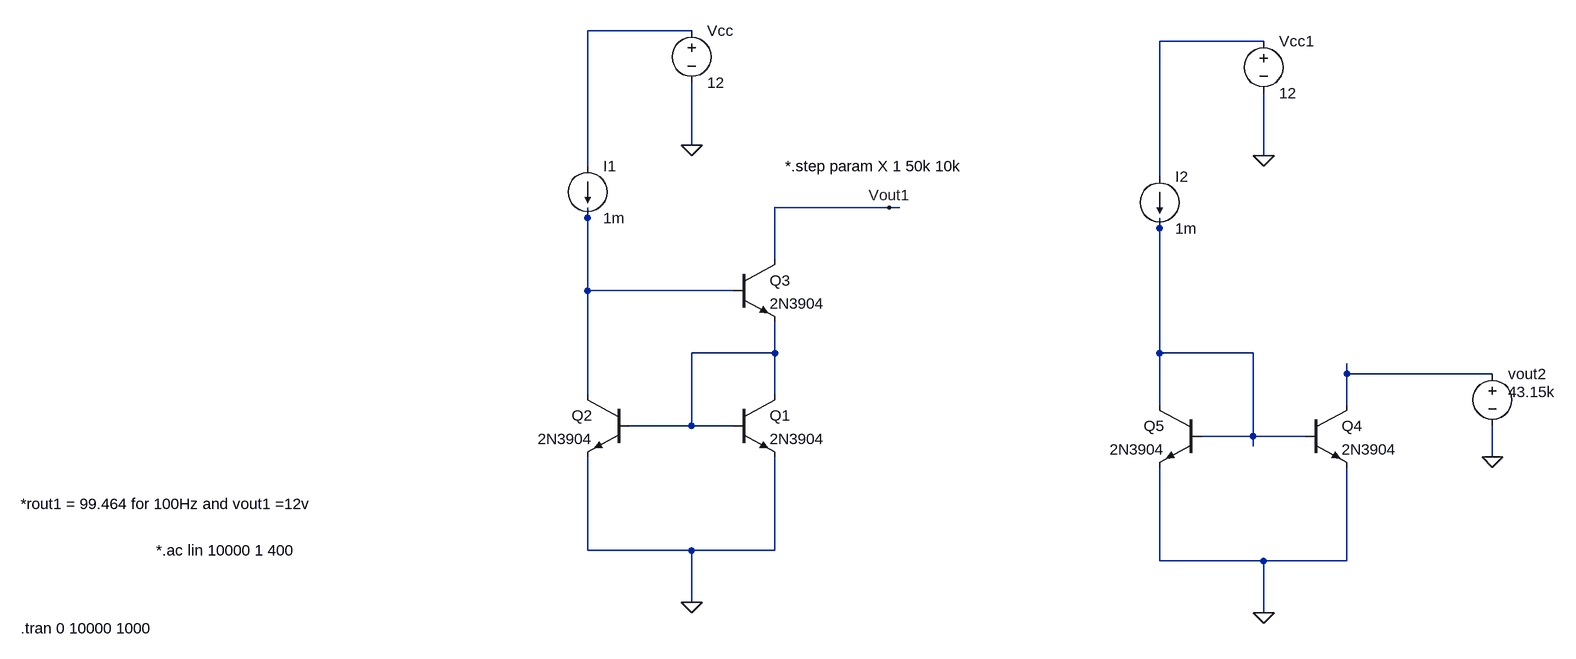
[diagram p0: schematic ask3.asc]
ask3.asc, the LTspice schematic file:
Version 4
SHEET 1 1724 680
WIRE 112 -640 -48 -640
WIRE 992 -624 832 -624
WIRE 112 -464 112 -560
WIRE 992 -448 992 -544
WIRE -48 -432 -48 -640
WIRE 832 -416 832 -624
WIRE 416 -368 240 -368
WIRE 432 -368 416 -368
WIRE -48 -352 -48 -368
WIRE 832 -336 832 -352
WIRE 240 -288 240 -368
WIRE -48 -240 -48 -352
WIRE 176 -240 -48 -240
WIRE 240 -144 240 -192
WIRE 240 -144 112 -144
WIRE 832 -144 832 -336
WIRE 976 -144 832 -144
WIRE 1120 -112 1120 -128
WIRE 1344 -112 1120 -112
WIRE -48 -80 -48 -240
WIRE 240 -80 240 -144
WIRE 832 -64 832 -144
WIRE 1120 -64 1120 -112
WIRE 112 -32 112 -144
WIRE 112 -32 16 -32
WIRE 176 -32 112 -32
WIRE 976 -16 976 -144
WIRE 976 -16 896 -16
WIRE 1056 -16 976 -16
WIRE 976 0 976 -16
WIRE 1344 16 1344 -32
WIRE -48 160 -48 16
WIRE 112 160 -48 160
WIRE 240 160 240 16
WIRE 240 160 112 160
WIRE 832 176 832 32
WIRE 992 176 832 176
WIRE 1120 176 1120 32
WIRE 1120 176 992 176
WIRE 112 240 112 160
WIRE 992 256 992 176
FLAG 112 240 0
FLAG 112 -464 0
FLAG 992 256 0
FLAG 992 -448 0
FLAG 1344 16 0
FLAG 416 -368 Vout1
SYMBOL npn 176 -80 R0
SYMATTR InstName Q1
SYMATTR Value 2N3904
SYMBOL npn 176 -288 R0
SYMATTR InstName Q3
SYMATTR Value 2N3904
SYMBOL npn 16 -80 M0
SYMATTR InstName Q2
SYMATTR Value 2N3904
SYMBOL current -48 -432 R0
SYMATTR InstName I1
SYMATTR Value 1m
SYMBOL voltage 112 -656 R0
WINDOW 123 0 0 Left 0
WINDOW 39 0 0 Left 0
SYMATTR InstName Vcc
SYMATTR Value 12
SYMBOL npn 1056 -64 R0
SYMATTR InstName Q4
SYMATTR Value 2N3904
SYMBOL npn 896 -64 M0
SYMATTR InstName Q5
SYMATTR Value 2N3904
SYMBOL current 832 -416 R0
SYMATTR InstName I2
SYMATTR Value 1m
SYMBOL voltage 992 -640 R0
WINDOW 123 0 0 Left 0
WINDOW 39 0 0 Left 0
SYMATTR InstName Vcc1
SYMATTR Value 12
SYMBOL voltage 1344 -128 R0
WINDOW 3 24 44 Left 2
WINDOW 39 0 0 Left 0
SYMATTR Value 43.15k
SYMATTR InstName vout2
SYMATTR Value2 AC 0
TEXT -712 160 Left 2 !*.ac lin 10000 1 400
TEXT -920 88 Left 2 !*rout1 = 99.464 for 100Hz and vout1 =12v
TEXT -920 280 Left 2 !.tran 0 10000 1000
TEXT 256 -432 Left 2 !*.step param X 1 50k 10k

The netlist it stands for:
* ask3.asc
Q1 N005 N005 0 0 2N3904
Q3 Vout1 N003 N005 0 2N3904
Q2 N003 N005 0 0 2N3904
I1 N001 N003 1m
Vcc N001 0 12
Q4 N006 N004 0 0 2N3904
Q5 N004 N004 0 0 2N3904
I2 N002 N004 1m
Vcc1 N002 0 12
vout2 N006 0 43.15k AC 0
.model NPN NPN
.model PNP PNP
.lib standard.bjt
*.ac lin 10000 1 400
*rout1 = 99.464 for 100Hz and vout1 =12v
.tran 0 10000 1000
*.step param X 1 50k 10k
.backanno
.end